# EAGLE board Clock (EAGLE 9.0.1)
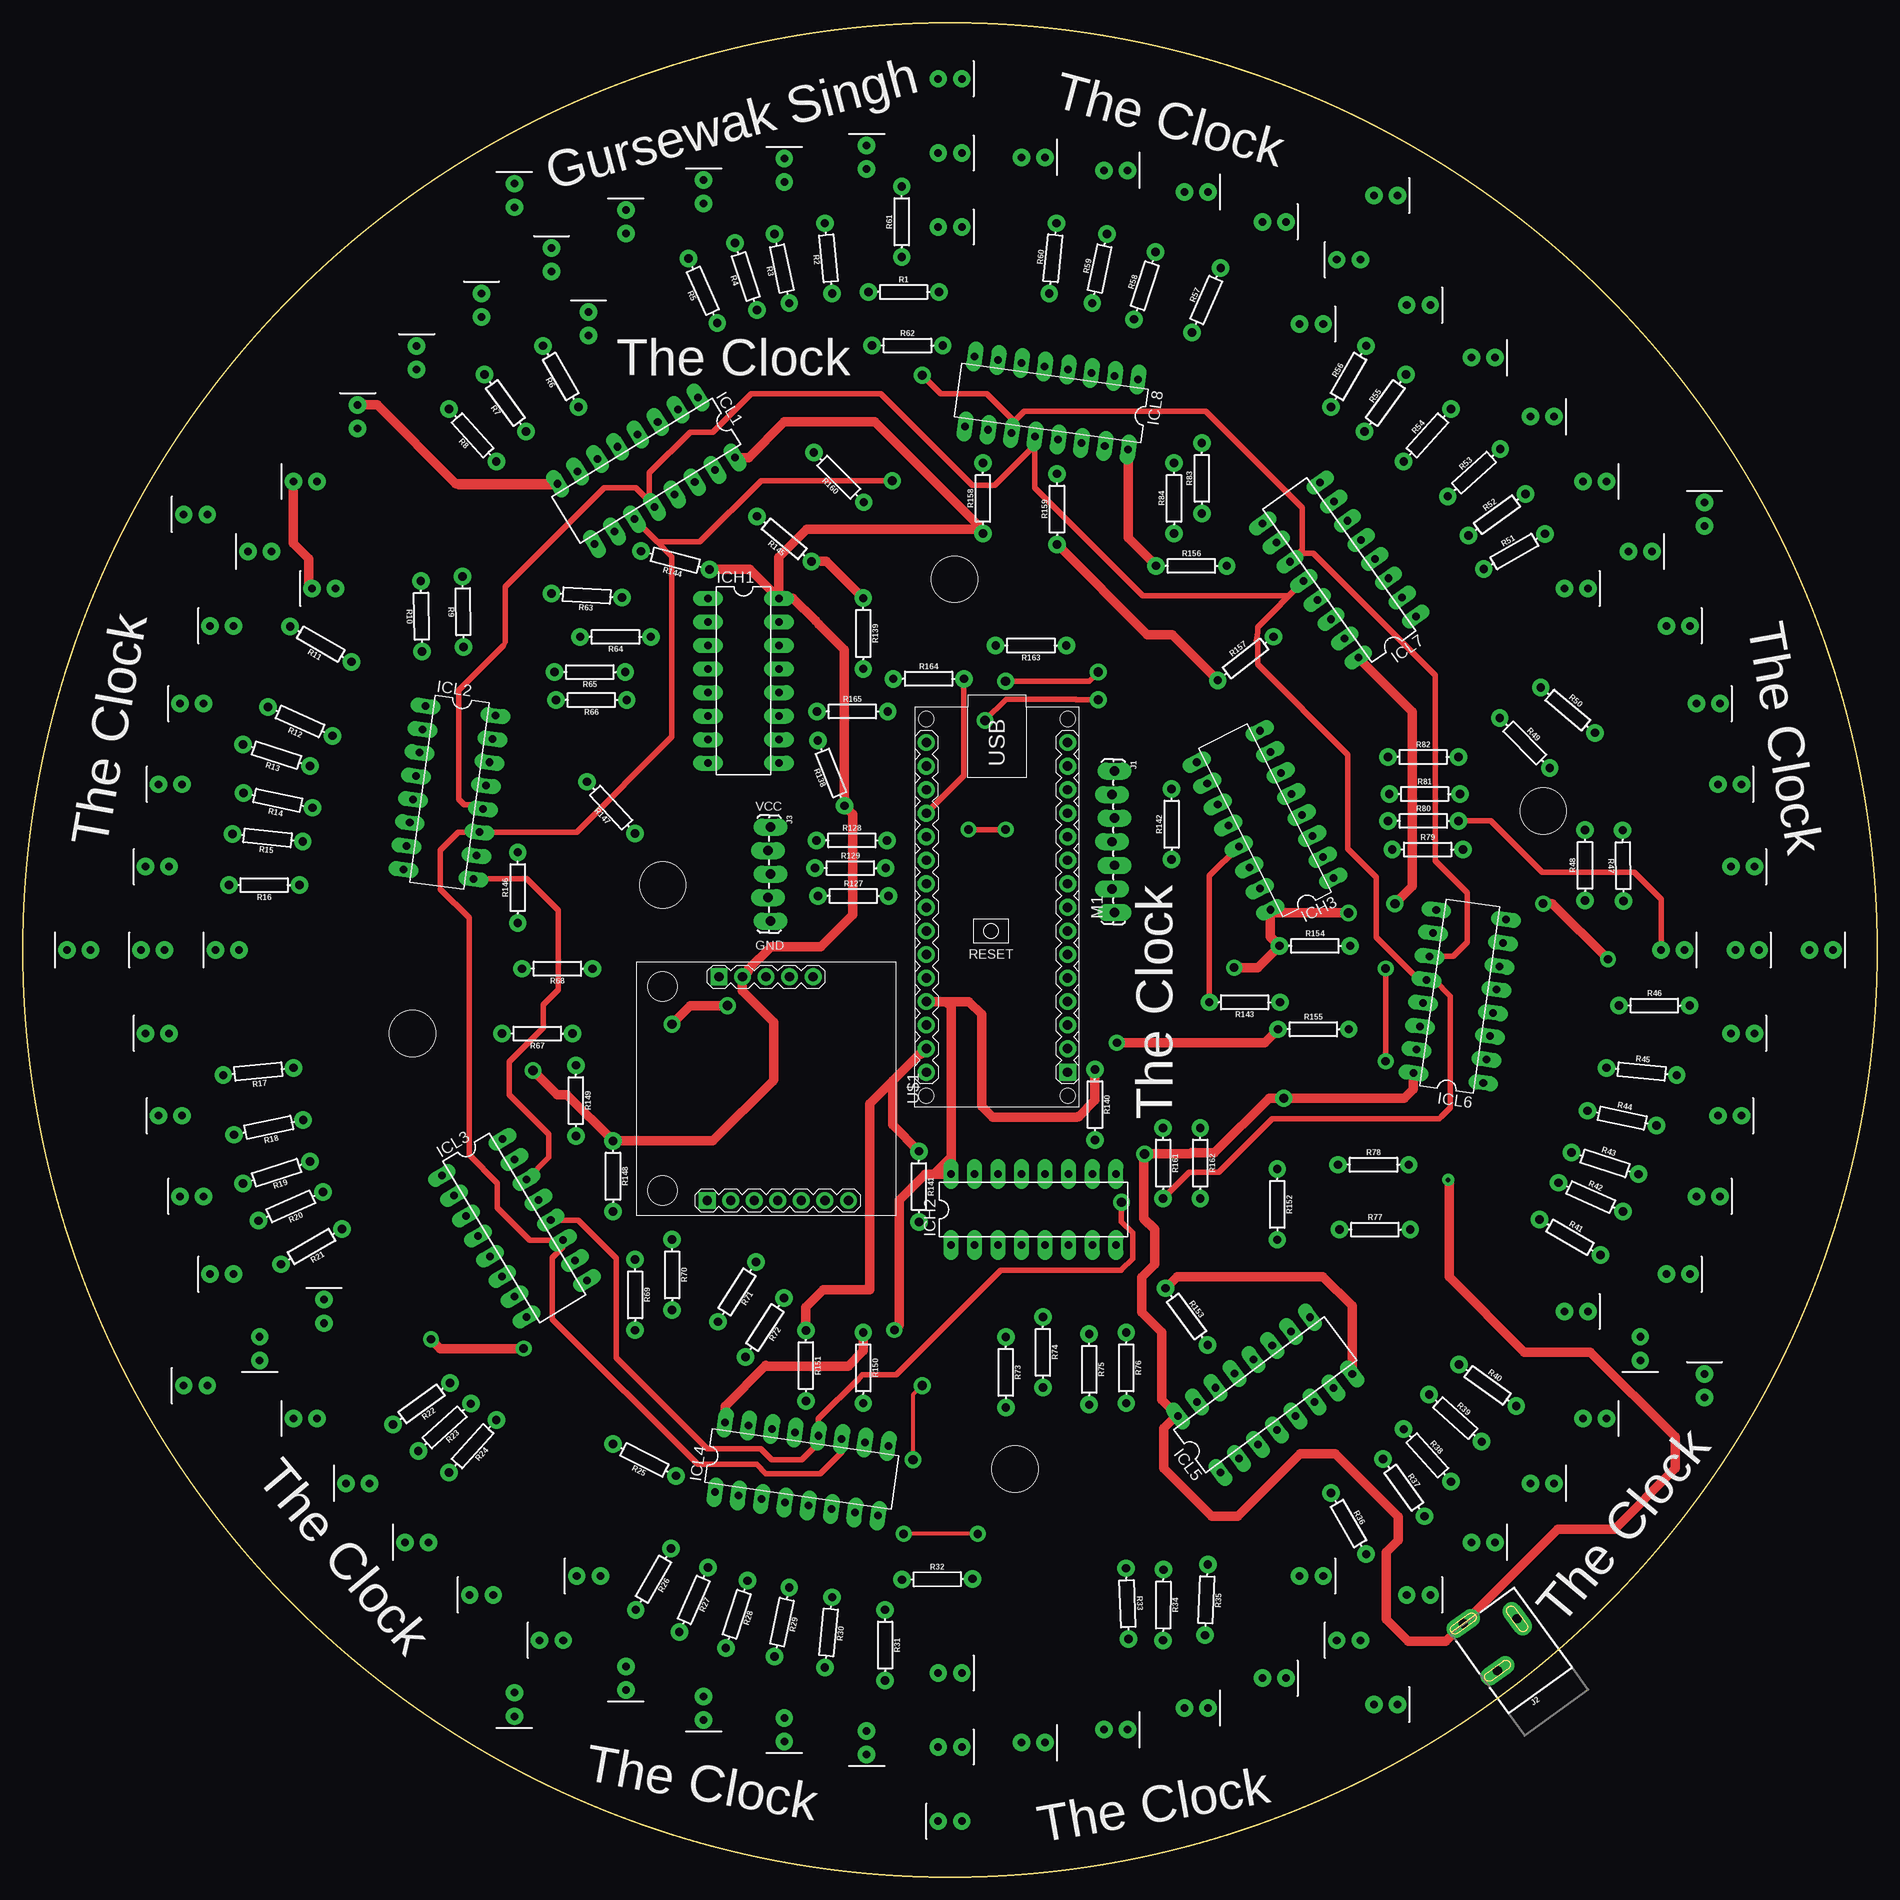
[diagram p2: board, top side]
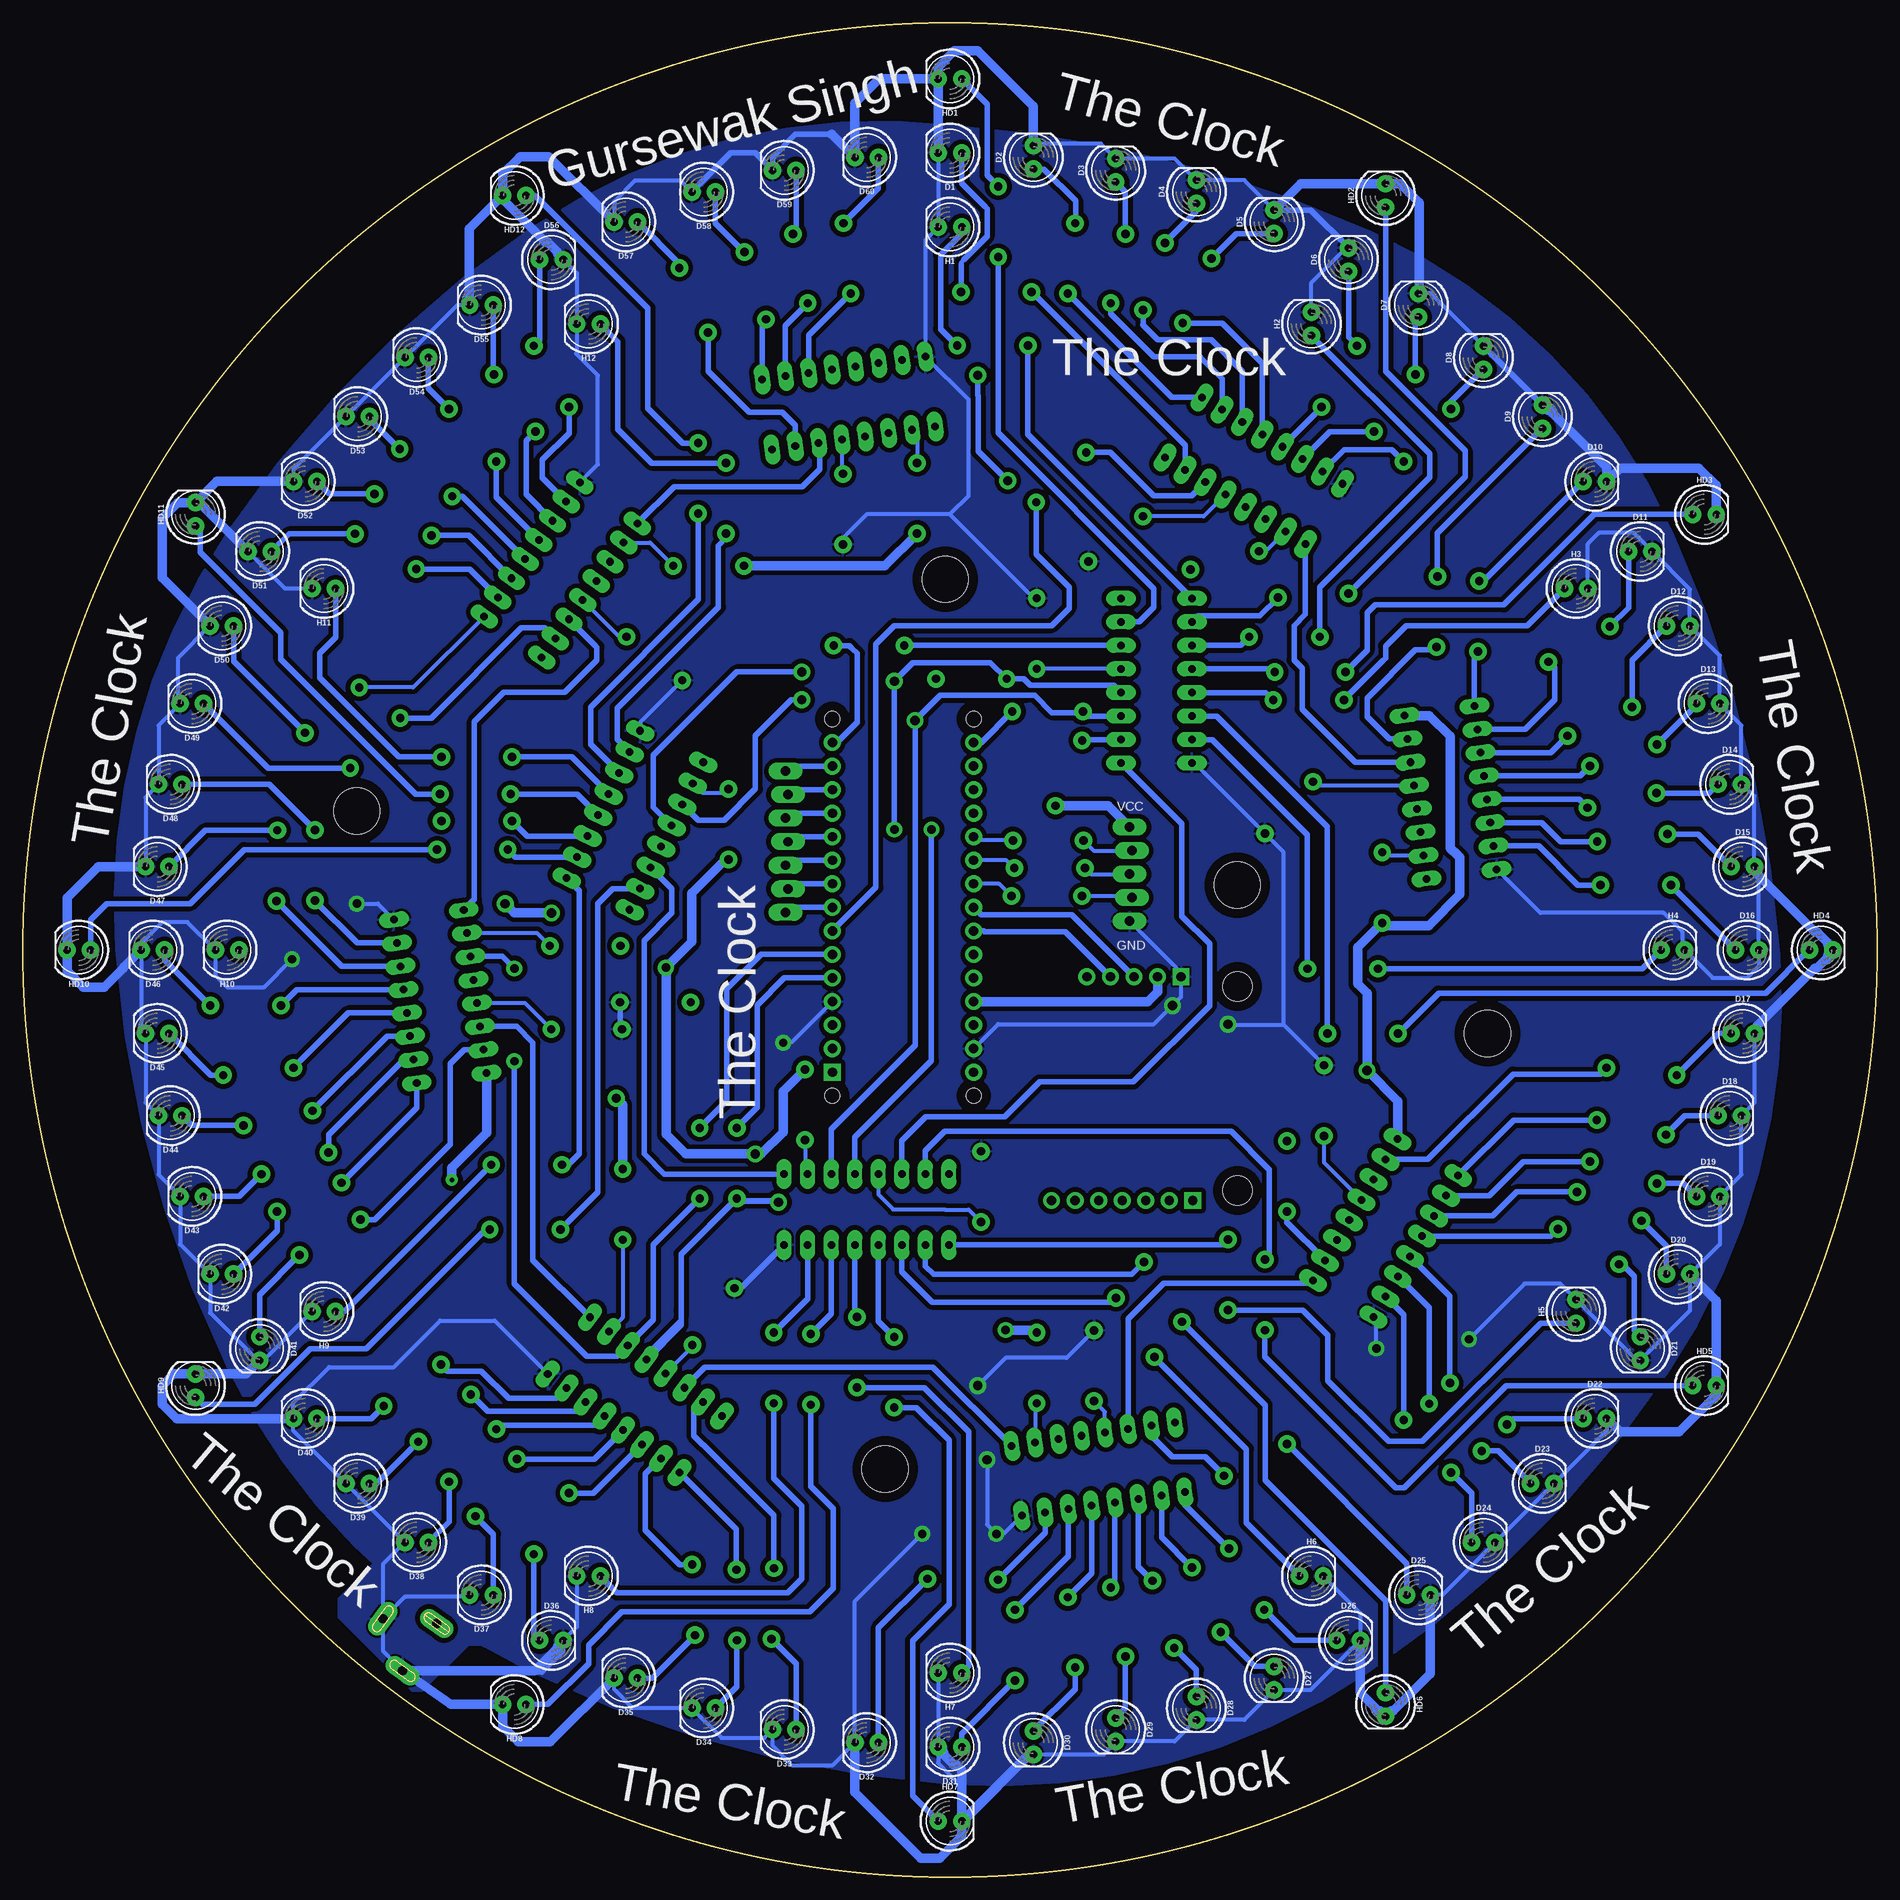
[diagram p3: board, bottom side, seen from below]

Size 200 x 200 mm. Coordinates in mm from the lower left corner, seen from the top.
Outline: circle at 100,100 radius 100
Copper layers (1*16): Top 0.035mm / dielectric 1.5mm / Bottom 0.035mm
Design rules "default *": minimum track width 0.4mm, minimum drill 0.5mm, track to track 20mil, track to pad 20mil, pad to pad 20mil, via to via 20mil, smd to smd 20mil, copper to edge 40mil, drill to drill 8mil, minimum pad ring 16mil, minimum via ring 16mil, stop-mask expansion 4mil, vias tented up to drill 1mm, thermal gap 10mil
Holes 5 mm at 69,107 100.5,140 107,44 42,91 164,115

## Footprints (pad centres in the part's own frame; a part is rotated, then mirrored left to right if it is on the bottom)
LED_5MM = drill 0.813 pad 1.88: A -1.27,0; K 1.27,0
DIL16 = drill 0.813 long: 1 -8.89,-3.81; 2 -6.35,-3.81; 3 -3.81,-3.81; 4 -1.27,-3.81; 5 1.27,-3.81; 6 3.81,-3.81; 7 6.35,-3.81; 8 8.89,-3.81; 9 8.89,3.81; 10 6.35,3.81; 11 3.81,3.81; 12 1.27,3.81; 13 -1.27,3.81; 14 -3.81,3.81; 15 -6.35,3.81; 16 -8.89,3.81
1X07_LOCK_LONGPADS = drill 1.016 long: 1 0,0.127; 2 2.54,-0.127; 3 5.08,0.127; 4 7.62,-0.127; 5 10.16,0.127; 6 12.7,-0.127; 7 15.24,0.127
POWER_JACK_SLOT = drill 1 pad 2 long: GND@1 2.58,7.5; GND@2 7.58,10.8; PWR 2.58,13.8
1X05_LOCK_LONGPADS = drill 1.016 long: 1 0,0; 2 2.54,-0.254; 3 5.08,0; 4 7.62,-0.254; 5 10.16,0
ARDUINO-NANO-3.0 = drill 1 square: J1.1 17.78,7.62 | drill 1: J1.2 15.24,7.62; J1.3 12.7,7.62; J1.4 10.16,7.62; J1.5 7.62,7.62; J1.6 5.08,7.62; J1.7 2.54,7.62; J1.8 0,7.62; J1.9 -2.54,7.62; J1.10 -5.08,7.62; J1.11 -7.62,7.62; J1.12 -10.16,7.62; J1.13 -12.7,7.62; J1.14 -15.24,7.62; J1.15 -17.78,7.62; J2.1 17.78,-7.62; J2.2 15.24,-7.62; J2.3 12.7,-7.62; J2.4 10.16,-7.62; J2.5 7.62,-7.62; J2.6 5.08,-7.62; J2.7 2.54,-7.62; J2.8 0,-7.62; J2.9 -2.54,-7.62; J2.10 -5.08,-7.62; J2.11 -7.62,-7.62; J2.12 -10.16,-7.62; J2.13 -12.7,-7.62; J2.14 -15.24,-7.62; J2.15 -17.78,-7.62 | hole 1.651: -20.32,7.62; -20.32,-7.62; 20.32,-7.62; 20.32,7.62
AXIAL-0.3 = drill 0.9 pad 1.88: P$1 -3.81,0; P$2 3.81,0
RTC-EEPROM-BATTERY = drill 1 square: J1.1 -12.065,-5.08; J2.1 12.065,-6.35 | drill 1: J1.2 -12.065,-2.54; J1.3 -12.065,0; J1.4 -12.065,2.54; J1.5 -12.065,5.08; J2.2 12.065,-3.81; J2.3 12.065,-1.27; J2.4 12.065,1.27; J2.5 12.065,3.81; J2.6 12.065,6.35; J2.7 12.065,8.89 | hole 3.2: -11,-11.176; 11,-11.176

## Placement (x,y rotation side)
D1  [LED_5MM]  100,186 180 bottom
D2  [LED_5MM]  91.01,185.53 90 bottom
D3  [LED_5MM]  82.12,184.12 90 bottom
D4  [LED_5MM]  73.42,181.79 90 bottom
D5  [LED_5MM]  65.02,178.56 90 bottom
D6  [LED_5MM]  57,174.48 90 bottom
D7  [LED_5MM]  49.45,169.58 90 bottom
D8  [LED_5MM]  42.45,163.91 90 bottom
D9  [LED_5MM]  36.09,157.55 90 bottom
D10  [LED_5MM]  30.42,150.55 0 bottom
D11  [LED_5MM]  25.52,143 0 bottom
D12  [LED_5MM]  21.44,134.98 0 bottom
D13  [LED_5MM]  18.21,126.58 0 bottom
D14  [LED_5MM]  15.88,117.88 0 bottom
D15  [LED_5MM]  14.47,108.99 0 bottom
D16  [LED_5MM]  14,100 0 bottom
D17  [LED_5MM]  14.47,91.01 0 bottom
D18  [LED_5MM]  15.88,82.12 0 bottom
D19  [LED_5MM]  18.21,73.42 0 bottom
D20  [LED_5MM]  21.44,65.02 0 bottom
D21  [LED_5MM]  25.52,57 270 bottom
D22  [LED_5MM]  30.42,49.45 0 bottom
D23  [LED_5MM]  36.09,42.45 0 bottom
D24  [LED_5MM]  42.45,36.09 0 bottom
D25  [LED_5MM]  49.45,30.42 0 bottom
D26  [LED_5MM]  57,25.52 0 bottom
D27  [LED_5MM]  65.02,21.44 270 bottom
D28  [LED_5MM]  73.42,18.21 270 bottom
D29  [LED_5MM]  82.12,15.88 270 bottom
D30  [LED_5MM]  91.01,14.47 270 bottom
D31  [LED_5MM]  100,14 180 bottom
D32  [LED_5MM]  108.99,14.47 180 bottom
D33  [LED_5MM]  117.88,15.88 180 bottom
D34  [LED_5MM]  126.58,18.21 180 bottom
D35  [LED_5MM]  134.98,21.44 180 bottom
D36  [LED_5MM]  143,25.52 0 bottom
D37  [LED_5MM]  150.55,30.42 180 bottom
D38  [LED_5MM]  157.55,36.09 180 bottom
D39  [LED_5MM]  163.91,42.45 180 bottom
D40  [LED_5MM]  169.58,49.45 180 bottom
D41  [LED_5MM]  174.48,57 270 bottom
D42  [LED_5MM]  178.56,65.02 180 bottom
D43  [LED_5MM]  181.79,73.42 180 bottom
D44  [LED_5MM]  184.12,82.12 180 bottom
D45  [LED_5MM]  185.53,91.01 180 bottom
D46  [LED_5MM]  186,100 180 bottom
D47  [LED_5MM]  185.53,108.99 180 bottom
D48  [LED_5MM]  184.12,117.88 180 bottom
D49  [LED_5MM]  181.79,126.58 180 bottom
D50  [LED_5MM]  178.56,134.98 180 bottom
D51  [LED_5MM]  174.48,143 180 bottom
D52  [LED_5MM]  169.58,150.55 180 bottom
D53  [LED_5MM]  163.91,157.55 180 bottom
D54  [LED_5MM]  157.55,163.91 180 bottom
D55  [LED_5MM]  150.55,169.58 180 bottom
D56  [LED_5MM]  143,174.48 0 bottom
D57  [LED_5MM]  134.98,178.56 180 bottom
D58  [LED_5MM]  126.58,181.79 180 bottom
D59  [LED_5MM]  117.88,184.12 180 bottom
D60  [LED_5MM]  108.99,185.53 180 bottom
H1  [LED_5MM]  100,178 180 bottom
H2  [LED_5MM]  61,167.55 90 bottom
H3  [LED_5MM]  32.45,139 0 bottom
H4  [LED_5MM]  22,100 0 bottom
H5  [LED_5MM]  32.45,61 90 bottom
H6  [LED_5MM]  61,32.45 0 bottom
H7  [LED_5MM]  100,22 180 bottom
H8  [LED_5MM]  139,32.45 180 bottom
H9  [LED_5MM]  167.55,61 180 bottom
H10  [LED_5MM]  178,100 180 bottom
H11  [LED_5MM]  167.55,139 180 bottom
H12  [LED_5MM]  139,167.55 180 bottom
HD1  [LED_5MM]  100,194 180 bottom
HD2  [LED_5MM]  53,181.41 90 bottom
HD3  [LED_5MM]  18.59,147 0 bottom
HD4  [LED_5MM]  6,100 0 bottom
HD5  [LED_5MM]  18.59,53 0 bottom
HD6  [LED_5MM]  53,18.59 270 bottom
HD7  [LED_5MM]  100,6 0 bottom
HD8  [LED_5MM]  147,18.59 180 bottom
HD9  [LED_5MM]  181.41,53 90 bottom
HD10  [LED_5MM]  194,100 180 bottom
HD11  [LED_5MM]  181.41,147 90 bottom
HD12  [LED_5MM]  147,181.41 180 bottom
ICH1  74HC595N  [DIL16]  77.72,129.05 270 top
ICH2  74HC595N  [DIL16]  109,72 0 top
ICH3  74HC595N  [DIL16]  134,114 116.5 top
ICL1  74HC595N  [DIL16]  67.22,151.72 211.6 top
ICL2  74HC595N  [DIL16]  46,117 262.2 top
ICL3  74HC595N  [DIL16]  53,70 300.9 top
ICL4  74HC595N  [DIL16]  84,44 351.8 top
ICL5  74HC595N  [DIL16]  134,52 36.8 top
ICL6  74HC595N  [DIL16]  155,95 82 top
ICL7  74HC595N  [DIL16]  142,141 125.5 top
ICL8  74HC595N  [DIL16]  110.94,159.02 172 top
J1  [1X07_LOCK_LONGPADS]  117.62,119.3 270 top
J2  POWER_JACKSLT  [POWER_JACK_SLOT]  161.38,14.64 35.9 top
J3  [1X05_LOCK_LONGPADS]  80.62,113.27 270 top
M1  ARDUINO-NANO-3.0  [ARDUINO-NANO-3.0]  105.07,104.6 270 top
R1  220  [AXIAL-0.3]  95,171 0 top
R2  220  [AXIAL-0.3]  86.89,174.63 96 top
R3  220  [AXIAL-0.3]  81.86,173.51 102 top
R4  220  [AXIAL-0.3]  77.99,172.67 108 top
R5  220  [AXIAL-0.3]  73.34,171.12 114 top
R6  220  [AXIAL-0.3]  58,161.89 120 top
R7  220  [AXIAL-0.3]  52.03,159.01 126 top
R8  220  [AXIAL-0.3]  48.5,155.53 132 top
R9  220  [AXIAL-0.3]  47.47,136.5 90.8 top
R10  220  [AXIAL-0.3]  42.97,136.01 91 top
R11  220  [AXIAL-0.3]  32.11,133 150 top
R12  220  [AXIAL-0.3]  29.88,124.66 156 top
R13  220  [AXIAL-0.3]  27.33,121.01 162 top
R14  220  [AXIAL-0.3]  27.49,116.14 168 top
R15  220  [AXIAL-0.3]  26.37,112.11 174 top
R16  220  [AXIAL-0.3]  26,107 180 top
R17  220  [AXIAL-0.3]  25.37,86.89 186 top
R18  220  [AXIAL-0.3]  26.49,80.86 192 top
R19  220  [AXIAL-0.3]  27.33,75.99 198 top
R20  220  [AXIAL-0.3]  28.88,72.34 204 top
R21  220  [AXIAL-0.3]  31.11,68 210 top
R22  220  [AXIAL-0.3]  42.99,51.03 216 top
R23  220  [AXIAL-0.3]  45.47,48.5 222 top
R24  220  [AXIAL-0.3]  48.5,46.47 228 top
R25  220  [AXIAL-0.3]  67.03,44.99 153.2 top
R26  220  [AXIAL-0.3]  68,32.11 240 top
R27  220  [AXIAL-0.3]  72.34,29.88 246 top
R28  220  [AXIAL-0.3]  76.99,28.33 252 top
R29  220  [AXIAL-0.3]  81.86,27.49 258 top
R30  220  [AXIAL-0.3]  86.89,26.37 264 top
R31  220  [AXIAL-0.3]  93,25 270 top
R32  220  [AXIAL-0.3]  98.63,32.11 0.7 top
R33  220  [AXIAL-0.3]  119.14,29.49 272.1 top
R34  220  [AXIAL-0.3]  123.01,29.33 269.6 top
R35  220  [AXIAL-0.3]  127.66,29.88 267.6 top
R36  220  [AXIAL-0.3]  143,38.11 300 top
R37  220  [AXIAL-0.3]  148.97,41.99 306 top
R38  220  [AXIAL-0.3]  151.5,45.47 312 top
R39  220  [AXIAL-0.3]  154.53,49.5 318 top
R40  220  [AXIAL-0.3]  158.01,53.03 324 top
R41  220  [AXIAL-0.3]  166.89,69 330 top
R42  220  [AXIAL-0.3]  169.12,73.34 336 top
R43  220  [AXIAL-0.3]  170.67,76.99 342 top
R44  220  [AXIAL-0.3]  172.51,81.86 348 top
R45  220  [AXIAL-0.3]  174.63,86.89 354 top
R46  220  [AXIAL-0.3]  176,94 0 top
R47  220  [AXIAL-0.3]  172.63,109.11 90.7 top
R48  220  [AXIAL-0.3]  168.51,109.14 90 top
R49  220  [AXIAL-0.3]  162.01,122.33 315 top
R50  220  [AXIAL-0.3]  166.66,125.88 320.1 top
R51  220  [AXIAL-0.3]  160.89,143 30 top
R52  220  [AXIAL-0.3]  159.01,146.97 36 top
R53  220  [AXIAL-0.3]  156.53,151.5 42 top
R54  220  [AXIAL-0.3]  151.5,155.53 48 top
R55  220  [AXIAL-0.3]  146.97,159.01 54 top
R56  220  [AXIAL-0.3]  143,161.89 60 top
R57  220  [AXIAL-0.3]  127.66,170.12 66 top
R58  220  [AXIAL-0.3]  121.01,171.67 72 top
R59  220  [AXIAL-0.3]  116.14,173.51 78 top
R60  220  [AXIAL-0.3]  111.11,174.63 84 top
R61  220  [AXIAL-0.3]  94.79,178.57 90 top
R62  220  [AXIAL-0.3]  95.41,165.21 0 top
R63  220  [AXIAL-0.3]  60.79,138.25 176.5 top
R64  220  [AXIAL-0.3]  63.91,133.79 180 top
R65  220  [AXIAL-0.3]  61.15,129.98 180 top
R66  220  [AXIAL-0.3]  61.31,126.98 180 top
R67  220  [AXIAL-0.3]  55.47,90.98 180 top
R68  220  [AXIAL-0.3]  57.63,97.98 180 top
R69  220  [AXIAL-0.3]  66.02,62.79 270 top
R70  220  [AXIAL-0.3]  70.02,64.95 270 top
R71  220  [AXIAL-0.3]  77.02,63.11 237.7 top
R72  220  [AXIAL-0.3]  80.02,59.27 237 top
R73  220  [AXIAL-0.3]  106.02,54.43 270 top
R74  220  [AXIAL-0.3]  110.02,56.59 270 top
R75  220  [AXIAL-0.3]  115.02,54.75 270 top
R76  220  [AXIAL-0.3]  119.02,54.91 270 top
R77  220  [AXIAL-0.3]  145.85,69.83 0 top
R78  220  [AXIAL-0.3]  145.69,76.83 0 top
R79  220  [AXIAL-0.3]  151.53,110.83 0 top
R80  220  [AXIAL-0.3]  151.07,113.93 0 top
R81  220  [AXIAL-0.3]  151.21,116.83 0 top
R82  220  [AXIAL-0.3]  151.05,120.83 0 top
R83  220  [AXIAL-0.3]  127.17,150.89 90 top
R84  220  [AXIAL-0.3]  124.17,148.73 90 top
R127  10  [AXIAL-0.3]  89.57,105.83 0 top
R128  10  [AXIAL-0.3]  89.41,111.83 0 top
R129  10  [AXIAL-0.3]  89.25,108.83 0 top
R138  10k  [AXIAL-0.3]  87.17,119.09 112.1 top
R139  10k  [AXIAL-0.3]  90.64,134.15 270 top
R140  10k  [AXIAL-0.3]  115.64,83.31 270 top
R141  10k  [AXIAL-0.3]  96.64,74.47 270 top
R142  10k  [AXIAL-0.3]  123.91,113.57 90 top
R143  10k  [AXIAL-0.3]  131.79,94.36 180 top
R144  10k  [AXIAL-0.3]  70.36,142.05 165.1 top
R145  10k  [AXIAL-0.3]  82.11,144.36 140.3 top
R146  10k  [AXIAL-0.3]  53.36,106.73 90 top
R147  10k  [AXIAL-0.3]  63.43,115.36 132.9 top
R148  10k  [AXIAL-0.3]  63.64,75.59 270 top
R149  10k  [AXIAL-0.3]  59.64,83.75 270 top
R150  10k  [AXIAL-0.3]  90.64,54.91 270 top
R151  10k  [AXIAL-0.3]  84.45,55.15 270 top
R152  10k  [AXIAL-0.3]  135.31,72.55 270 top
R153  10k  [AXIAL-0.3]  125.53,60.45 306.6 top
R154  10k  [AXIAL-0.3]  139.37,100.45 0 top
R155  10k  [AXIAL-0.3]  139.21,91.45 0 top
R156  10k  [AXIAL-0.3]  126.05,141.45 0 top
R157  10k  [AXIAL-0.3]  131.89,131.45 38.1 top
R158  10k  [AXIAL-0.3]  103.55,148.73 90 top
R159  10k  [AXIAL-0.3]  111.55,147.57 90 top
R160  10  [AXIAL-0.3]  88,151 135 top
R161  10  [AXIAL-0.3]  123,77 270 top
R162  10  [AXIAL-0.3]  127,77 270 top
R163  10  [AXIAL-0.3]  108.74,132.85 180 top
R164  10  [AXIAL-0.3]  97.69,129.26 0 top
R165  10  [AXIAL-0.3]  89.47,125.74 0 top
U$1  RTC-EEPROM-BATTERY  [RTC-EEPROM-BATTERY]  80.15,85.04 270 top

## Tracks (layer width: path | path; a pad name or v marks a point on that pad's centre or on a via)
GND  (via drill 0.9, 1)
  Top 0.406: v97,53 96,52 v96,45 | 57.53,150.18 ICL1.8 | 47,150 38.37,158.63 arc45 37.93,158.81
  Top 0.45: v103,37 v95,37
  Top 0.61: D9.K 38.19,158.81 47,150 57.34,150 57.53,150.18
  Top 1: ICL1.8 46.69,150.31 38.19,158.81 | 37.93,158.81 D9.K | R151.P$1 84.45,61.45 86.35,63.35 91.35,63.35 91.35,83.43 93.8,85.88 | R141.P$1 93.8,81.12 93.8,85.88 | M1.J2.2 96.82,88.73 96.66,88.73 93.8,85.88 | R159.P$1 121.28,134.03 123.97,134.03 R157.P$1 | R145.P$1 86.67,141.93 R139.P$1 | ICL5.8 143.4,61.6 140.24,64.76 124.51,64.76 R153.P$1 | v171,99 165,105 v164,105 | v70,92 72,94 v76,94 | v44,58 45,57 v54,57 | D10.K 29.16,143.87 30.83,142.2 30.83,139.35 H3.K | v118,90 133.95,90 R155.P$1
  Bottom 0.406: R149.P$1 64,91.92 | 66.23,112.77 64,110.55 64,91.92 | R151.P$1 87.41,56 94,56 v97,53 | v96,45 96,38 v95,37 | v70,92 arc-45 69.81,91.92 64,91.92 | 102.67,176.6 H1.K D1.K | D2.K 91.01,187 | 91.01,187 91.01,191.01 | 91.01,187 83.73,187 D3.K 75.75,185.39 D4.K 68.25,183.06 D5.K 64.6,179.83 | 61.09,179.83 57.13,175.87 | 57.13,175.87 D6.K | H2.K 61,172 57.13,175.87 | D8.K 48.12,170.84 49.35,170.84 D7.K | 26.25,145 D11.K 20.17,138.91 D12.K 16.94,131.75 D13.K 14.61,124.25 14.61,118 | H3.K 31.18,143.82 | D14.K 14.61,118 | 14.61,118 13.2,116.59 D15.K 12.73,108.52 D16.K 12.73,98.27 | 17.73,97 H4.K 21,100.27 21,102 | D17.K 13.2,83.53 D18.K 14.61,75.75 D19.K 16.94,68.25 D20.K 20.17,61.09 D21.K 25.91,55.73 H5.K 34.18,64 38,64 | D22.K 29.16,48.12 D23.K D24.K 46.85,30.42 D25.K | H6.K 55.73,28.45 D26.K | 55.73,25.17 D26.K | D26.K 61.09,20.17 D27.K 68.25,16.94 D28.K 75.75,14.61 82,14.61 | 82,14.61 D29.K | 82,14.61 83.41,13.2 90.75,13.2 D30.K 98.21,6 HD7.K 98.73,9.73 101.27,12.27 D31.K 101.27,14.03 H7.K | 112.73,12 D32.K 110.26,29.74 | 119.15,14.15 D33.K 120.03,15 124.64,15 D34.K 134.21,18.21 136.25,20.25 D35.K | 151.91,22.23 J2.GND@1 | 141.73,24.27 D36.K 140.27,26.98 H8.K | D37.K 152.04,30.2 158.81,30.2 | J2.GND@2 161.19,33.72 D38.K D39.K 170.84,48.12 D40.K 170.84,51.16 | D41.K 174.6,55.6 | 174.6,55.6 175.1,55.1 | 175.1,55.1 175.94,54.27 | H9.K 174.72,55.1 175.1,55.1 | 174.6,55.6 179.83,60.84 D42.K 183.06,68.25 D43.K 185.39,75.75 D44.K 186.8,83.53 D45.K | D45.K | D45.K 187.27,91.47 D46.K 187.27,100.73 | 179.27,97.27 H10.K 182.27,103 | 189.13,98.14 189.22,98.05 | D47.K 186.8,116.47 D48.K 185.39,124.25 183.32,126.32
  Bottom 0.406: D49.K 183.32,126.32 | D50.K 179.91,134.91 | 179.91,134.91 183.32,131.5 183.32,126.32 | 175.82,143.08 D51.K 171.75,139 H11.K | 185,146.57 185,140 179.91,134.91 | 170.87,150.58 D52.K 170.84,151.88 D53.K D54.K 153.15,169.57 152,169.57 | D55.K 151.85,169.57 152,169.57 | 140.36,164.36 140.27,164.45 H12.K 140.27,173.02 D56.K 148.27,181.02 HD12.K | 148.43,181.25 152,177.68 152,169.57 | 136.25,180.75 D57.K | D58.K 129.06,183 | 110.26,191.05 110.26,191.35 | R139.P$1 90.96,137.96 100,147
  Bottom 0.45: J3.5 75.07,97.56 U$1.J1.1 75.07,94.93 v76,94 78,92 94.81,92 M1.J2.2 | 102.67,176.6 ICL8.8 98,159.36 98,149 100,147 109,147 111.55,144.45 R159.P$1 | R157.P$1 133.44,124.55 ICH3.8 | 158.81,30.2 J2.GND@2 161.19,24.42 159,22.23 | J2.GND@1 159,22.23 | 159,22.23 151.91,22.23 151.68,22 144,22 141.73,24.27 | 182.27,103 185,103 187.27,100.73 | ICL7.8 138,152.39 138,162 140.36,164.36 | 146.39,185.61 146.5,185.5 | 129.06,183 134,183 136.25,180.75 | 26.25,145 30,145 31.18,143.82 | 12.73,98.27 14,97 17.73,97 | ICL2.8 36.31,104 23,104 21,102 | 38,64 v44,58 | v54,57 54,60.12 ICL3.8 | 110.26,29.74 v103,37 | 112.73,12 117,12 119.15,14.15 | ICL5.8 149.13,60 155,60 160,55 167,55 170.84,51.16 | 179.27,97.27 178,96 174,96 v171,99 | v164,105 161.74,105 ICL6.8 | M1.J1.4 117.13,90 v118,90 | ICL4.8 94.22,37 v95,37 | R147.P$1 66.23,112.77 73.61,120.16 ICH1.8
  Bottom 0.61: ICH2.8 122.57,63.51 R153.P$1 | D8.K D9.K | D6.K 61.09,179.83 64.6,179.83 | D58.K 123.64,186 121.03,186 D59.K 119.15,185.55 116.67,188.03 112.76,188.03 | 49.45,180.7 D7.K | R155.P$1 135.6,91.65 R143.P$1
  Bottom 1: 189.22,98.05 191.27,96 193.53,96 195.27,97.75 HD10.K 195.27,105.64 191.93,108.99 D47.K | HD11.K 183.31,148.27 185,146.57 185,140.14 D50.K | HD11.K 179.1,150.58 170.87,150.58 | HD11.K 181.02,148.27 175.82,143.08 | 174.6,55.6 175.94,54.27 HD9.K 183.73,54.27 185,53 185,51 183.45,49.45 D40.K | D36.K 142.32,24.93 142.32,24.72 144.81,22.23 J2.GND@1 153.88,18.59 HD8.K 148.27,16.27 146.57,14.58 143.11,14.58 D35.K | HD7.K 98.73,11.48 99.3,12.05 99.54,12.05 100.68,13.19 100.68,13.43 101.27,14.03 | HD7.K 98.73,4.37 101.1,2 103.13,2 110.26,9.12 D32.K | HD7.K 91.53,13.2 90.75,13.2 | 55.73,25.17 55.73,19.84 53.81,17.92 53.59,17.92 HD6.K 52.41,17.92 52.19,17.92 48.18,21.93 D25.K | D22.K 27.7,48 21.3,48 17.32,51.98 HD5.K 17.32,62.18 D20.K | D17.K 13.2,91.53 6.68,98.05 6.46,98.05 5.32,99.19 5.32,99.41 HD4.K 5.32,100.59 5.32,100.81 6.46,101.95 6.68,101.95 13.2,108.47 D15.K | HD3.K 17.32,150.12 19.2,152 27.7,152 D10.K 29.16,152.09 35.28,158.22 35.5,158.22 D9.K | 49.35,170.84 49.35,180.6 49.45,180.7 51.43,182.68 HD2.K 62.18,182.68 D5.K | HD1.K D1.K | HD1.K 107.61,194 110.26,191.35 | 110.26,191.05 D60.K 112.76,188.03 | HD1.K 101.27,195.25 99.53,197 97,197 91.01,191.01 D2.K | 148.43,181.25 HD12.K 148.27,183.73 146.5,185.5 | 148.43,181.25 151.85,177.83 151.85,169.57 | 148.43,181.25 148.43,181.17 143.68,176.43 143.46,176.43 142.32,175.28 142.32,175.07 D56.K | D57.K 143.3,185.61 146.39,185.61 | D46.K 189.13,98.14
  pour Bottom: 100,189 arc20 54.5,177.5 arc41 22,145 arc20 10.5,99.5 arc38 22.5,54.5 arc22 55,22 arc38 100,10 arc22 145,22 arc38 178,55 arc22 190,100 arc38 178,145 arc22 145,178 arc40
  pour Bottom: 150,25 152,25 157,20 158,20 166,28 166,30 162,34 159,34
N$48
  Bottom 0.61: U$1.J1.4 87.55,101.96 96.28,101.96 96.38,102.06 M1.J2.7
N$49
  Bottom 0.61: U$1.J1.3 86.84,103.8 96.65,103.8 M1.J2.8
N$50
  Bottom 0.61: M1.J1.8 117.21,104.6 J1.7
N$51
  Bottom 0.61: M1.J1.9 116.95,107.14 J1.6
N$52
  Bottom 0.61: M1.J1.10 117.21,109.68 J1.5
N$53
  Bottom 0.61: M1.J1.11 116.95,112.22 J1.4
N$54
  Bottom 0.61: M1.J1.12 117.21,114.76 J1.3
N$55
  Bottom 0.61: M1.J1.13 116.95,117.3 J1.2
N$56
  Bottom 0.61: M1.J1.14 117.21,119.84 J1.1
N$57
  Bottom 0.61: ICL1.5 59.91,158.54 R6.P$1
N$58
  Bottom 0.61: ICL1.7 57.45,154 52.35,154 R8.P$1
N$59
  Bottom 0.45: 71.83,165.82 71.85,165.85
  Bottom 0.61: ICL1.3 68.47,162.47 71.83,165.82 | 71.85,165.85 77.58,165.85 79.2,167.47 79.16,167.51 R4.P$1
N$60
  Bottom 0.61: ICL1.4 66.31,163.31 70.64,167.64 R5.P$1
N$61
  Bottom 0.45: 72.92,163.93 73,164
  Bottom 0.61: ICL1.2 70.63,161.63 72.92,163.93 | 73,164 78,164 82.65,168.65 R3.P$1
N$62
  Bottom 0.61: ICL1.1 76.08,159.62 R2.P$1
N$63
  Bottom 0.61: ICL1.6 59.02,155.93 R7.P$1
N$64
  Bottom 0.45: 59.28,113.28 59.28,113
  Bottom 0.61: ICH1.6 71.24,125.24 59.28,113.28 | 59.28,113 R67.P$1
N$65
  Bottom 0.45: 98.81,171.25 R1.P$2 | 98.81,174 98.81,174.19 98.54,174.46 | 96.19,180.19 96,180
  Bottom 0.61: D1.A 98.73,182.73 96.19,180.19 | 96,180 96,177 98.54,174.46 | 98.81,174 98.81,171.25
N$66
  Bottom 0.61: D2.A 89.88,184.26 86.45,180.82 86.45,178.46 R2.P$2
N$67
  Bottom 0.61: D3.A 81.07,181.8 R3.P$2
N$68
  Bottom 0.61: D4.A 73.42,179.68 R4.P$2
N$69
  Bottom 0.61: D5.A 69.1,177.3 R5.P$2
N$70
  Bottom 0.61: D6.A 57,166.09 R6.P$2
N$71
  Bottom 0.61: D7.A 49.79,167.97 R7.P$2
N$72
  Bottom 0.61: D8.A 45.95,159.15 R8.P$2
N$73
  Bottom 0.61: ICL1.15 74.62,154.44 R1.P$1
N$74
  Bottom 0.61: ICL2.6 36.17,113.74 34.12,111.7 30.17,111.7 R15.P$1
N$75
  Bottom 0.61: D9.A 47.41,144.95 R9.P$2
N$76
  Bottom 0.61: D10.A 42.42,139.82 R10.P$2
N$77
  Bottom 0.61: R11.P$2 26.79,136.92 D11.A
N$78
  Bottom 0.61: R12.P$2 26.4,131.29 D12.A
N$79
  Bottom 0.61: R13.P$2 19.48,126.42 D13.A
N$80
  Bottom 0.61: D14.A 18.1,116.93 R14.P$2
N$81
  Bottom 0.61: D15.A 19.26,112.51 R15.P$2
N$82
  Bottom 0.61: D16.A 22.19,106.92 R16.P$2
N$83
  Bottom 0.61: ICL2.7 36.48,111.23 32.25,107 R16.P$1
N$84
  Bottom 0.61: ICL2.15 52.62,122.77 55,125.15 55,127.17 49.77,132.4 47.81,132.4 R9.P$1
N$85
  Bottom 0.61: ICL2.5 32.13,116.26 R14.P$1
N$86
  Bottom 0.61: ICL2.2 37.94,123.81 34.78,126.97 34.78,130.46 R11.P$1
N$87
  Bottom 0.61: ICL2.1 43.43,131.81 R10.P$1
N$88
  Bottom 0.61: ICL2.3 35.18,121.29 R12.P$1
N$89
  Bottom 0.61: ICL2.4 32.01,118.78 R13.P$1
N$90
  Bottom 0.45: 85.22,153.69 R160.P$2
  Bottom 0.61: ICL1.14 73.93,149 78,149 82.69,153.69 85.22,153.69
N$91
  Bottom 0.61: ICL3.6 48.3,61.38 R23.P$1
N$92
  Bottom 0.61: R17.P$2 17.07,91.01 D17.A
N$93
  Bottom 0.61: D18.A 20.71,82.12 R18.P$2
N$94
  Bottom 0.61: D19.A 20.86,74.81 R19.P$2
N$95
  Bottom 0.61: D20.A 22.7,68.1 R20.P$2
N$96
  Bottom 0.61: D21.A 26.2,58.95 26.2,64.83 27.47,66.09 R21.P$2
N$97
  Bottom 0.61: R22.P$2 39.24,49.45 D22.A
N$98
  Bottom 0.45: 42.5,45.95 R23.P$2
  Bottom 0.61: D23.A 40.85,45.95 42.5,45.95
N$99
  Bottom 0.61: D24.A 43.73,41.41 R24.P$2
N$100
  Bottom 0.61: ICL3.7 51.05,60.65 R24.P$1
N$101
  Bottom 0.61: ICL3.15 48.45,77.41 39.25,86.6 29.85,86.6 R17.P$1
N$102
  Bottom 0.61: ICL3.5 46.07,62.64 R22.P$1
N$103
  Bottom 0.61: ICL3.2 41.82,73.49 38.15,77.16 R19.P$1
N$104
  Bottom 0.61: ICL3.1 39.18,81.65 R18.P$1
N$105
  Bottom 0.61: ICL3.3 41.45,71.31 38.88,73.89 R20.P$1
N$106
  Bottom 0.61: ICL3.4 35.18,69.13 R21.P$1
N$107
  Bottom 0.61: R61.P$2 96,183.59 96,191.27 HD1.A
N$108
  Bottom 0.61: ICL4.6 87.23,34.58 R31.P$1
N$109
  Bottom 0.61: D25.A 50.72,33.8 R25.P$2
N$110
  Bottom 0.61: R26.P$2 62.81,25.52 D26.A
N$111
  Bottom 0.61: D27.A 67.1,22.7 R27.P$2
N$112
  Bottom 0.61: D28.A 73.42,22.32 R28.P$2
N$113
  Bottom 0.61: D29.A 81.07,18.2 R29.P$2
N$114
  Bottom 0.61: D30.A 86.49,20.26 R30.P$2
N$115
  Bottom 0.61: D31.A 98.73,15.46 R31.P$2
N$116
  Bottom 0.45: 102.46,32.13 R32.P$2
  Bottom 0.61: D32.A 107.72,26.87 102.46,32.13
N$117
  Bottom 0.61: ICL4.7 89.74,37.14 R32.P$1
N$118
  Bottom 0.61: ICL4.15 78.26,47.56 76,45.3 72.45,45.3 R25.P$1
N$119
  Bottom 0.61: ICL4.5 84.71,32.74 R30.P$1
N$120
  Bottom 0.61: ICL4.2 77.17,36.64 R27.P$1
N$121
  Bottom 0.61: ICL4.1 74.66,40.16 R26.P$1
N$122
  Bottom 0.61: ICL4.3 79.69,33.47 R28.P$1
N$123
  Bottom 0.61: ICL4.4 82.2,31.67 R29.P$1
N$124  (via drill 1)
  Top 0.406: 128.82,76 129,76 | 152.78,81.78 153,82 | 47,118.1 47,118.08 | 52,133.26 arc-45 51.82,132.82 | 118.46,65.46 118.5,65.5 | 90.14,53.76 90.19,53.81
  Top 0.61: ICL3.12 59.88,70.87 64,66.74 64,56 73.82,46.18 78.48,46.18 78.58,46.17 78.6,46.18 79.56,46.18 80.74,45 84,45 85.8,46.8 ICL4.12 85.8,49.42 90.14,53.76 | 90.19,53.81 90.56,54.18 94.18,54.18 105.46,65.46 118.46,65.46 | R161.P$2 125.81,76 128.82,76 | 129,76 134.78,81.78 152.78,81.78 | 153,82 154,83 154,95.03 152.24,96.79 ICL6.12 150.59,96.79 146,101.38 146,107.88 142.93,110.95 142.93,121.08 133.18,130.82 133.18,133.14 133.06,133.29 133.18,134.29 133.18,134.84 ICL7.12 136.54,138.2 120.8,138.2 109.15,149.85 ICL8.12 109.15,154.48 104.84,150.16 102.39,150.16 92.55,160 78.58,160 74.42,155.85 71.95,155.85 67.58,151.47 67.58,148.37 ICL1.12 66.07,149.88 62.7,149.88 52,139.18 52,133.26 | 51.82,132.82 47,128 47,118.1 | 47,118.08 47,116.25 47.6,115.65 49.18,115.65 ICL2.12 | 118.5,65.5 119.71,66.71 119.71,69.48 118.5,70.69 v118.5,72.78
  Bottom 0.406: v118.5,72.78 123.22,72.78
  Bottom 0.45: R161.P$2 123,73 123.08,72.92 123.22,72.78 129,67 129,61.1 | 129,60.38 129,60
  Bottom 0.61: v118.5,72.78 118.65,72.92 123.08,72.92 | R161.P$2 129,67.19 129,61.1 129,60.38 129,59.55 ICL5.12 132.74,56.27 129,60
N$125
  Bottom 0.61: ICL5.6 140.33,50.24 149.89,50.24 R39.P$1
N$126
  Bottom 0.61: D33.A 116.61,23.01 R33.P$2
N$127
  Bottom 0.61: D34.A 122.99,20.53 R34.P$2
N$128
  Bottom 0.61: D35.A 132.14,21.44 R35.P$2
N$129
  Bottom 0.61: D36.A 144.91,26.16 R36.P$2
N$130
  Bottom 0.61: D37.A 149.28,36.98 R37.P$2
N$131
  Bottom 0.61: D38.A 154.05,38.31 R38.P$2
N$132
  Bottom 0.61: D39.A 161.86,42.45 R39.P$2
N$133
  Bottom 0.61: D40.A 162.44,49.45 R40.P$2
N$134
  Bottom 0.61: R40.P$1 154.22,54.56 150.56,54.56 147.62,51.62 142.5,51.62 ICL5.7
N$135
  Bottom 0.61: R33.P$1 119,39 126.63,46.63 126.66,46.63 127.62,47.6 127.62,50.26 ICL5.15
N$136
  Bottom 0.61: ICL5.5 138.31,48.7 148.12,48.7 148.53,48.3 R38.P$1
N$137
  Bottom 0.61: ICL5.2 132.88,43.47 132.88,37.4 129.16,33.69 R35.P$1
N$138
  Bottom 0.61: ICL5.1 123.04,37.5 R34.P$1
N$139
  Bottom 0.61: ICL5.3 138.49,41.41 R36.P$1
N$140
  Bottom 0.61: ICL5.4 138.38,45.07 R37.P$1
N$141
  Bottom 0.61: ICL1.9 61.65,136.23 62.88,135 62.88,131.28 62,130.4 62,126 56.26,120.26 ICL2.14
N$142
  Bottom 0.61: R47.P$1 165.62,98.24 ICL6.6
N$143
  Bottom 0.61: D41.A 174.48,62.81 R41.P$2
N$144
  Bottom 0.61: D42.A 172.6,69.71 R42.P$2
N$145
  Bottom 0.61: D43.A 176.68,73.42 R43.P$2
N$146
  Bottom 0.61: D44.A 181.8,81.07 R44.P$2
N$147
  Bottom 0.61: D45.A 179.74,86.49 R45.P$2
N$148
  Bottom 0.45: 180,94.19 R46.P$2
  Bottom 0.61: D46.A 184.73,98.92 180,94.19
N$149
  Bottom 0.61: R47.P$2 180.33,112.92 D47.A
N$150
  Bottom 0.61: R48.P$2 173.45,117.88 D48.A
N$151
  Bottom 0.61: ICL6.7 163.94,100.76 R48.P$1
N$152
  Bottom 0.61: ICL6.15 152.43,89.24 153.93,87.75 153.93,79.05 162.07,70.91 R41.P$1
N$153
  Bottom 0.61: ICL6.5 170.46,95.73 R46.P$1
N$154
  Bottom 0.61: ICL6.2 158.92,88.18 167.05,80.05 R43.P$1
N$155
  Bottom 0.61: ICL6.1 157.54,83 R42.P$1
N$156
  Bottom 0.61: ICL6.3 160.75,90.7 R44.P$1
N$157
  Bottom 0.61: ICL6.4 164.92,93.21 R45.P$1
N$158
  Top 0.61: ICL2.9 54.35,107.67 57.75,104.28 57.75,95.72 56.1,94.08 56.1,91.6 52.42,87.92 52.42,84.38 56.7,80.1 56.7,77.61 ICL3.14
N$159
  Bottom 0.61: R55.P$1 145.72,154.94 145.72,149.15 ICL7.6
N$160
  Bottom 0.61: D49.A 173.58,119.63 R49.P$2
N$161
  Bottom 0.61: D50.A 177.3,131.15 R50.P$2
N$162
  Bottom 0.61: R51.P$2 171.3,144.91 D51.A
N$163
  Bottom 0.61: D52.A 166.97,149.21 R52.P$2
N$164
  Bottom 0.61: D53.A 162.64,157.32 R53.P$2
N$165
  Bottom 0.61: D54.A 156.28,160.59 R54.P$2
N$166
  Bottom 0.406: 149.28,162.43 149.28,162.17 R55.P$2
  Bottom 0.61: D55.A 149.28,162.43
N$167
  Bottom 0.61: D56.A 144.27,165.82 R56.P$2
N$168
  Bottom 0.61: R56.P$1 141.09,155.78 144,152.88 144,150.97 ICL7.7
N$169
  Bottom 0.61: ICL7.15 143.72,134.75 146.25,134.75 155.98,125.02 R49.P$1
N$170
  Bottom 0.61: R54.P$1 148.95,148.83 ICL7.5
N$171
  Bottom 0.61: ICL7.2 151.84,141.09 R51.P$1
N$172
  Bottom 0.45: ICL7.1 157.92,128.32 R50.P$1
N$173
  Bottom 0.61: ICL7.3 151.93,144.73 R52.P$1
N$174
  Bottom 0.61: ICL7.4 152.61,148.95 R53.P$1
N$175
  Bottom 0.61: ICL3.9 61.1,64.06 76.94,64.06 80.77,60.23 ICL4.14
N$176
  Bottom 0.61: ICL4.9 101.84,55 126.44,55 ICL5.14
N$177
  Bottom 0.61: R57.P$2 129.21,174.06 D57.A
N$178
  Bottom 0.61: D58.A 125.31,178.41 R58.P$2
N$179
  Bottom 0.61: D59.A 116.61,177.56 R59.P$2
N$180
  Bottom 0.61: D60.A 107.72,182.2 R60.P$2
N$181
  Bottom 0.45: 146.76,91.76 147,91.76
  Bottom 0.61: ICL5.9 145,66.54 145,90 146.76,91.76 | 147,91.76 ICL6.14
N$182
  Bottom 0.45: 138.1,132.68 138.21,132.79
  Bottom 0.61: ICL6.9 151.32,105.47 151.32,124.62 148.15,127.8 141.55,127.8 138.1,131.25 138.1,132.68 | 138.21,132.79 ICL7.14
N$183
  Bottom 0.61: ICL7.9 129.76,150 115.95,150 114.08,151.88 114.08,154.61 ICL8.14
N$184  (via drill 0.9, 1)
  Top 0.406: 45,106.58 45,107 | 46.97,112.71 47,112.71 ICL2.11 49.52,112.71 59.45,112.71 arc45 59.89,112.89 70,123 | ICL7.11 137.62,142.82 137.82,143.02 arc45 138,143.46 138,147.74
  Top 0.61: 45,106.58 48.11,103.46 48.11,77.89 51.15,74.85 51.15,72.2 54.66,68.69 ICL3.11 58.23,67.94 57.09,66.81 57.09,60.16 72.76,44.5 79.12,44.5 80.12,43.5 86,43.5 88.31,45.81 ICL4.11 | 45,107 45,110.74 46.97,112.71 | 47,112.71 49.52,112.71 | ICL2.11 59.71,112.71 70,123 70,142.45 68.42,144.03 | v93.78,150.62 79.62,150.62 73.03,144.03 68.42,144.03 | v147,88 v147,98 | ICL6.11 154.3,99.3 155.82,100.82 155.82,106.18 152.36,109.64 152.36,129.64 139.18,142.82 137.62,142.82 | ICL7.11 138,143.2 138,147.74 127.59,158.15 108.03,158.15 106.64,156.76 ICL8.11 106.64,157.31 103.95,160 99,160 v97,162 | ICL1.11 68.42,144.03
  Bottom 0.61: v147,88 147,64 139.18,56.18 135.92,56.18 135.04,57.06 ICL5.11 132,60.1 132,68.19 R162.P$2 | v147,98 148.3,99.3 ICL6.11 | v97,162 97,159.83 96.96,159.79 96.96,153.81 v93.78,150.62
N$185
  Bottom 0.61: H1.A 98.73,177.27 101,175 101,166.99 R62.P$2
N$186
  Bottom 0.61: R57.P$1 126.11,162.43 121.67,158 120.67,158 120.34,158 118.08,158 116.7,156.62 ICL8.15
N$187
  Bottom 0.61: HD2.A 53,162.43 44.42,153.85 44.42,151.05 R63.P$2
N$188
  Bottom 0.61: ICL8.2 117.76,167.38 R59.P$1
N$189
  Bottom 0.61: ICL8.1 120.27,167.61 R58.P$1
N$190
  Bottom 0.61: ICL8.3 115.24,166.31 R60.P$1
N$191
  Bottom 0.61: H2.A 48.26,153.54 48.26,151 60.1,139.16 R64.P$2
N$192
  Bottom 0.61: HD3.A 30.47,147 40.24,137.24 54.14,137.24 55,136.38 55,132.32 R65.P$2
N$193
  Bottom 0.45: 53,131.48 53.24,131.24
  Bottom 0.61: H3.A 37.72,135 50.77,135 53,132.78 53,131.48 | 53.24,131.24 R66.P$2
N$194
  Bottom 0.406: 7.31,99.96 HD4.A
  Bottom 0.61: R67.P$2 47.28,95.36 12,95.36 7.4,99.96 7.31,99.96
N$195
  Bottom 0.61: H4.A 25.29,97.98 R68.P$2
N$196
  Bottom 0.61: R68.P$1 61.44,112.44 71.7,122.7 ICH1.7
N$197
  Bottom 0.61: ICH1.15 79.6,135.4 78,137 78,139 94.79,155.79 R61.P$1
N$198
  Bottom 0.61: ICH1.5 65.92,127.78 R66.P$1
N$199
  Bottom 0.61: ICH1.2 73.27,136.04 66.57,136.04 R63.P$1
N$200
  Bottom 0.61: ICH1.1 91.6,155.63 R62.P$1
N$201
  Bottom 0.61: ICH1.3 68.65,132.86 R64.P$1
N$202
  Bottom 0.61: ICH1.4 65.3,130.32 R65.P$1
N$203
  Bottom 0.61: ICH2.6 112.81,60.77 R75.P$1
N$204
  Bottom 0.61: HD5.A 40,53 51,42 51.92,42 66.02,56.09 R69.P$2
N$205
  Bottom 0.61: H5.A 36.27,59.73 49.02,46.98 52.67,46.98 59.23,53.52 59.23,58.44 61.92,61.14 R70.P$2
N$206
  Bottom 0.61: HD6.A 53,29.78 66,42.77 66,50.91 R71.P$2
N$207
  Bottom 0.61: H6.A 68.01,38.19 68.01,46.14 R72.P$2
N$208
  Bottom 0.45: 105.7,50.62 R73.P$2
  Bottom 0.61: HD7.A 104.03,8.75 104.03,25.47 100.1,29.4 100.1,47.1 103.62,50.62 105.7,50.62
N$209
  Bottom 0.45: 102.78,52.78 103,52.78
  Bottom 0.61: H7.A 98,22.73 98,48 102.78,52.78 | 103,52.78 R74.P$2
N$210
  Bottom 0.61: HD8.A 143.41,18.59 139,23 139,25 135.43,28.58 115.15,28.58 112.6,31.12 112.6,39.7 115.02,42.12 R75.P$2
N$211
  Bottom 0.61: H8.A 135.93,30.65 117.53,30.65 116,32.17 116,40 119.02,43.02 R76.P$2
N$212
  Bottom 0.61: ICH2.7 115.35,62.39 R76.P$1
N$213
  Bottom 0.61: ICH2.15 102.65,78.35 100.58,80.42 69.67,80.42 65.55,76.3 65.55,67.07 R69.P$1
N$214
  Bottom 0.61: ICH2.5 110.27,60.65 R74.P$1
N$215
  Bottom 0.61: ICH2.2 102.65,65.88 101.78,65 80.39,65 R71.P$1
N$216
  Bottom 0.61: ICH2.1 70.59,68.19 R70.P$1
N$217
  Bottom 0.61: ICH2.3 105.19,65.27 101.92,62 82.56,62 R72.P$1
N$218
  Bottom 0.61: ICH2.4 107.73,59.95 R73.P$1
N$219
  Bottom 0.61: ICH3.6 138.79,122.19 138.79,126.21 127.17,137.83 R83.P$1
N$220
  Bottom 0.45: 175.22,51 175,51
  Bottom 0.61: HD9.A 180.68,51 175.22,51 | 175,51 169,57 163,57 150.17,69.83 R77.P$2
N$221
  Bottom 0.61: R78.P$2 165.33,61 H9.A
N$222
  Bottom 0.61: HD10.A 192.73,103.27 191,105 182,105 176.17,110.83 R79.P$2
N$223
  Top 0.61: R80.P$2 158.34,113.93 163.9,108.38 173.82,108.38 176.73,105.47 H10.A
N$224
  Bottom 0.61: R81.P$2 157.66,116.83 172.2,131.38 172.2,134.22 180.88,142.9 180.88,145.2 HD11.A
N$225
  Bottom 0.61: H11.A 166.28,133.72 168,132 168,129.35 159.47,120.83 R82.P$2
N$226
  Bottom 0.61: HD12.A 144.76,181.41 132.6,169.25 132.6,158.47 128.82,154.7 R83.P$2
N$227
  Bottom 0.61: H12.A 135.82,165.64 135.82,156.18 132.19,152.54 R84.P$2
N$228
  Bottom 0.61: ICH3.7 135.91,122.72 135.91,126.09 125,137 125,143.62 124.17,144.45 R84.P$1
N$229
  Bottom 0.61: ICH3.15 136.38,106.62 138,105 138,73.87 R77.P$1
N$230
  Bottom 0.61: ICH3.5 140.84,120.83 R82.P$1
N$231
  Bottom 0.61: ICH3.2 146.91,110.02 R79.P$1
N$232
  Bottom 0.61: R78.P$1 141.17,76.83 140,78 140,106.37 ICH3.1
N$233
  Bottom 0.61: ICH3.3 145.62,112.29 R80.P$1
N$234
  Bottom 0.61: ICH3.4 140.24,116.83 R81.P$1
N$235
  Bottom 0.61: ICH1.14 R163.P$2
N$236  (via drill 1)
  Top 0.61: v116,127 113.64,127 113.58,127.07 106.07,127.07 v103.77,124.77
  Bottom 0.406: 85.52,125.6 R165.P$1
  Bottom 0.61: ICH3.11 127.18,114 124.38,114 121,117.38 121,123.12 117.12,127 v116,127 | ICH2.11 112.81,80.68 103.77,89.72 v103.77,124.77 101.04,127.5 91.86,127.5 91.83,127.47 90.87,127.47 89,125.6 85.52,125.6 85.16,125.24 ICH1.11
N$237  (via drill 0.9, 1)
  Top 0.61: v106,129 115,129 v116,130 | v102,113 v106,113
  Bottom 0.61: ICH1.12 82.34,128.59 91.37,128.59 92.04,129.26 R164.P$1 95.63,131.01 102.23,131.01 102.24,131 104,131 v106,129 v106,113 | v116,130 123,130 132,121 132,115.41 ICH3.12 | ICH2.12 110.27,79.78 102,88.05 v102,113
N$238
  Bottom 0.61: ICH2.14 105.19,79.44 102.62,82 94.1,82 90.33,85.78 80.22,85.78 72,94 72,100.65 75,103.65 75,113.63 ICH1.9
N$239
  Bottom 0.61: ICH2.9 130.81,75.81 133,78 133,101 130,104 130,106.6 ICH3.14
N$250
  Bottom 0.45: R127.P$2 94.69,107.14 M1.J2.9
N$290
  Bottom 0.61: ICH1.10 85.66,122.7 R138.P$2
N$291
  Bottom 0.45: ICH1.13 90.62,130.32 R139.P$2
N$292
  Bottom 0.45: R140.P$2 115.64,76.1 ICH2.10
N$293
  Bottom 0.406: R141.P$2 97.98,72 100.55,72 100.58,72.03 106.12,72.03 107.73,73.63 ICH2.13
N$294
  Bottom 0.45: ICH3.10 126.76,116.98 124.31,116.98 R142.P$2
N$295
  Top 0.61: ICH3.13 127.98,107.99 R143.P$2
N$296
  Bottom 0.45: ICL1.10 65.93,143.03 R144.P$2
N$297
  Bottom 0.45: ICL1.13 72.64,146.79 R145.P$2
N$298
  Bottom 0.45: ICL2.10 53.01,110.19 R146.P$2
N$299
  Bottom 0.45: ICL2.13 60.43,117.74 R147.P$2
N$300
  Bottom 0.61: R148.P$2 63.64,70.62 ICL3.10
N$301
  Bottom 0.406: ICL3.13 59.64,77.07 R149.P$2
N$302
  Bottom 0.45: R150.P$2 90.83,50.91 ICL4.10
N$303
  Bottom 0.406: ICL4.13 83.29,50.18 R151.P$2
N$304
  Bottom 0.45: R152.P$2 135.31,60.35 ICL5.10
N$305
  Bottom 0.45: R153.P$2 127.8,57.19 ICL5.13
N$306
  Bottom 0.45: R154.P$2 144.55,101.82 ICL6.10
N$307
  Bottom 0.45: R155.P$2 145.84,94.27 ICL6.13
N$308
  Bottom 0.45: ICL7.10 132.37,143.96 R156.P$2
N$309
  Bottom 0.406: ICL7.13 135.68,133.8 R157.P$2
N$310
  Bottom 0.45: ICL8.10 103.55,155.56 R158.P$2
N$311
  Bottom 0.45: ICL8.13 111.67,151.5 R159.P$2
N$312
  Bottom 0.406: 110.64,132.64 110.53,132.53
  Bottom 0.61: 110.53,132.53 110,132 110,124.58 112.19,122.38 M1.J1.15 | R163.P$1 110.85,132.85 110.64,132.64
N$313
  Bottom 0.45: R129.P$2 93.91,109.68 M1.J2.10
N$314
  Bottom 0.45: R128.P$2 97.06,111.83 M1.J2.11
N$316
  Bottom 0.61: M1.J2.15 96.64,122.38 R165.P$2
N$317
  Top 0.61: R164.P$2 101.5,118.81 M1.J2.12
N$318
  Bottom 0.61: M1.J1.7 108,106.75 108,133 106,135 89.03,135 87.15,136.88 87.15,139.15 90.69,142.69 R160.P$1
N$319
  Bottom 0.61: M1.J1.6 120.38,99.52 124.1,95.8 124.1,83.71 R162.P$1
N$320
  Bottom 0.61: R161.P$1 120.8,83.01 120.8,94.05 117.87,96.98 M1.J1.5
N$336
  Bottom 0.45: R127.P$1 80.55,105.83 J3.4
N$337
  Bottom 0.45: R128.P$1 84.5,110.73 J3.2
N$338
  Bottom 0.45: R129.P$1 84.8,108.19 J3.3
VCC  (via drill 0.5, 0.9, 1)
  Top 0.406: ICL5.16 124.6,49.9 | M1.J2.4 99.3,94.44 arc-45 99.74,94.26 99.81,94.19 | 77.08,153.13 ICL1.16 | 85.85,135.15 85.5,135.5 | 80.99,85.99 80.86,85.86
  Top 1: 124.6,49.9 123.08,48.38 123.08,44.08 128.25,38.9 131.05,38.9 137.78,45.62 141.57,45.62 148.38,38.83 148.38,36.3 147.07,35 147.07,27.8 149.45,25.42 153.47,25.42 J2.PWR 165.57,37.52 171.7,37.52 178.25,44.08 178.25,47.48 169.1,56.62 161.95,56.62 153.85,64.72 153.85,75.3 v153.75,75.2 | ICL5.16 122.83,51.5 122.83,58.75 120.67,60.9 120.67,64.67 122.08,66.08 122.08,69.85 120.9,71.03 120.9,77.45 120.67,77.67 v121,78 125.94,78 126.05,78.11 128.53,78.11 134.43,84 v136,84 149,84 149.99,84.99 ICL6.16 | v143,104 134.9,104 ICH3.16 134.56,101.45 R154.P$1 133.21,98.1 v130.65,98.1 | 100.11,77.67 ICH2.16 98.25,75.81 | 100.11,77.67 100.11,93.89 99.81,94.19 99.56,94.44 M1.J2.4 102.01,94.44 103.4,93.05 103.4,83.12 104.59,81.94 113.66,81.94 113.75,82.03 113.9,82.03 115.64,83.77 R140.P$1 | ICL8.16 119.21,144.48 R156.P$1 | ICH1.16 81.53,142.38 84.53,145.38 103.09,145.38 R158.P$1 103.55,145.32 91.89,156.97 82.12,156.97 78.28,153.13 77.08,153.13 | v55,87 57.62,84.38 58.66,84.38 R148.P$1 74.4,79.4 80.86,85.86 | 80.99,85.99 80.99,92.2 77.61,95.58 U$1.J1.2 78.24,97.73 78.24,97.9 80.69,100.35 86.05,100.35 89.53,103.83 89.53,114.64 R138.P$1 88.6,132.4 85.85,135.15 | ICL4.16 75.74,50.79 80.12,55.17 80.19,55.11 89,55.11 90.64,56.75 R150.P$1 | ICL7.16 149.9,125.71 149.9,106.9 v148,105 | 85.5,135.5 83.06,137.94 ICH1.16 | ICH1.16 78.4,141.07 R144.P$1 | v94,59 94.53,59.52 94.53,73 97.33,75.81 98.25,75.81 | 98.25,75.81 100.11,77.67
  Bottom 0.406: 56,100.28 53.64,102.64 | 53.64,102.64 R146.P$1 | 48.36,102.64 53.64,102.64 | 46.05,123.05 46,123 | 45.23,110.22 45,110
  Bottom 1: v143,104 147,104 v148,105 | R140.P$1 118,84.76 118,80.35 120.35,78 v121,78 128.5,78 130.62,80.12 130.62,98.08 v130.65,98.1 127.86,100.89 127.86,106.14 124.24,109.76 R142.P$1 | R156.P$1 107.02,141.45 R158.P$1 | ICL2.16 48.29,125.29 46.05,123.05 | 46,123 46,111 45.23,110.22 | 45,110 45,106 48.36,102.64 53.08,102.64 R146.P$1 56,100.28 56,96.35 55,95.35 v55,87 51.7,83.7 ICL3.16 | v94,59 90.92,59 R150.P$1 | R152.P$1 135.31,83.31 v136,84 | J3.1 82.91,115.56 R138.P$1 | U$1.J1.2 77.61,95.52 78.69,94.44 M1.J2.4 | v153.75,75.2 153.75,76.5 149.99,80.26 ICL6.16

## Text on the board
tPlace: The Clock | Gursewak Singh | The Clock | The Clock | VCC | The Clock | The Clock | GND | The Clock | The Clock | The Clock | The Clock
bPlace: The Clock | Gursewak Singh | The Clock | The Clock | VCC | The Clock | The Clock | GND | The Clock | The Clock | The Clock | The Clock